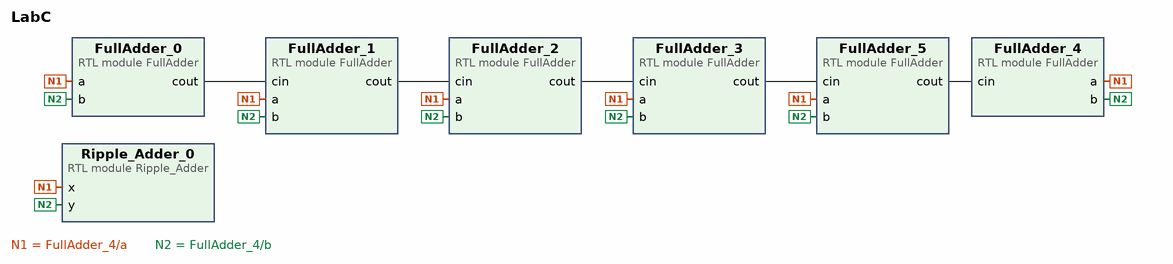
[diagram p0: block diagram of the top level]
# Vivado block design LabC, xc7a35tcpg236-1, Vivado 2017.4
create_bd_design LabC

create_bd_cell -type module -reference FullAdder FullAdder_0
create_bd_cell -type module -reference FullAdder FullAdder_1
create_bd_cell -type module -reference FullAdder FullAdder_2
create_bd_cell -type module -reference FullAdder FullAdder_3
create_bd_cell -type module -reference FullAdder FullAdder_4
create_bd_cell -type module -reference FullAdder FullAdder_5
create_bd_cell -type module -reference Ripple_Adder Ripple_Adder_0

# ---- connections ----

connect_bd_net [get_bd_pins FullAdder_0/cout] [get_bd_pins FullAdder_1/cin]
connect_bd_net [get_bd_pins FullAdder_1/cout] [get_bd_pins FullAdder_2/cin]
connect_bd_net [get_bd_pins FullAdder_2/cout] [get_bd_pins FullAdder_3/cin]
connect_bd_net [get_bd_pins FullAdder_3/cout] [get_bd_pins FullAdder_5/cin]
connect_bd_net [get_bd_pins FullAdder_5/cout] [get_bd_pins FullAdder_4/cin]
connect_bd_net [get_bd_pins FullAdder_4/a] \
  [get_bd_pins FullAdder_5/a] [get_bd_pins FullAdder_3/a] [get_bd_pins FullAdder_2/a] [get_bd_pins FullAdder_1/a] \
  [get_bd_pins FullAdder_0/a] [get_bd_pins Ripple_Adder_0/x]
connect_bd_net [get_bd_pins FullAdder_4/b] \
  [get_bd_pins FullAdder_2/b] [get_bd_pins FullAdder_1/b] [get_bd_pins FullAdder_0/b] [get_bd_pins FullAdder_5/b] \
  [get_bd_pins FullAdder_3/b] [get_bd_pins Ripple_Adder_0/y]

validate_bd_design
save_bd_design
